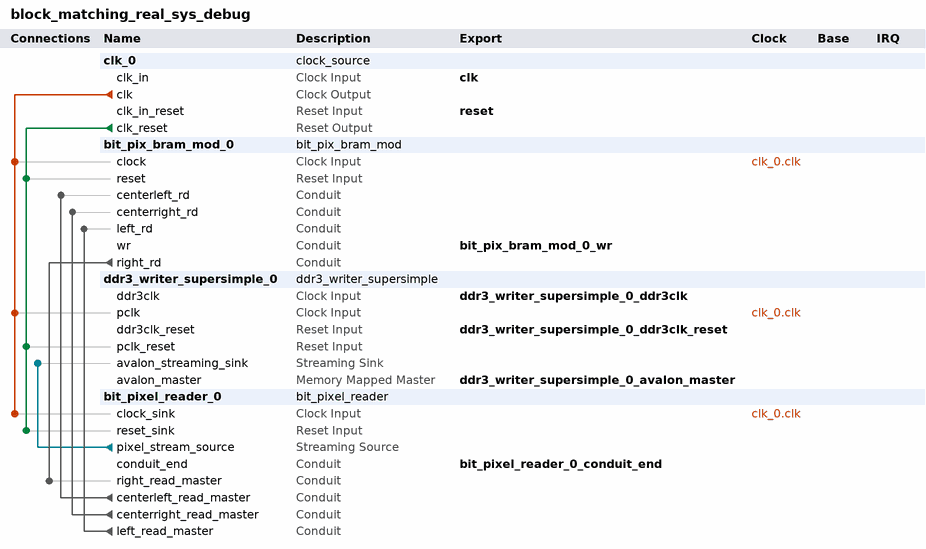
[diagram p0: system contents]
# Platform Designer (Qsys) system block_matching_real_sys_debug, Cyclone V 5CSEBA6U23I7
# Parameters at their usual value, and those the tool derives, are not listed.
package require -exact qsys 18.1
create_system block_matching_real_sys_debug
set_project_property DEVICE_FAMILY {Cyclone V}
set_project_property DEVICE 5CSEBA6U23I7

add_instance clk_0 clock_source 18.1
set_instance_parameter_value clk_0 clockFrequency 50000000

add_instance bit_pix_bram_mod_0 bit_pix_bram_mod 1.0
set_instance_parameter_value bit_pix_bram_mod_0 center_width 304
set_instance_parameter_value bit_pix_bram_mod_0 rd_width 8
set_instance_parameter_value bit_pix_bram_mod_0 third_height 480
set_instance_parameter_value bit_pix_bram_mod_0 third_width 240
set_instance_parameter_value bit_pix_bram_mod_0 wr_width 16

add_instance ddr3_writer_supersimple_0 ddr3_writer_supersimple 1.0
set_instance_parameter_value ddr3_writer_supersimple_0 burst_len 8
set_instance_parameter_value ddr3_writer_supersimple_0 in_width 64
set_instance_parameter_value ddr3_writer_supersimple_0 num_pixels 376320
set_instance_parameter_value ddr3_writer_supersimple_0 start_address 922746880

add_instance bit_pixel_reader_0 bit_pixel_reader 1.0
set_instance_parameter_value bit_pixel_reader_0 center_width 304
set_instance_parameter_value bit_pixel_reader_0 third_height 480
set_instance_parameter_value bit_pixel_reader_0 third_width 240

# connections
add_connection clk_0.clk bit_pix_bram_mod_0.clock clock
add_connection clk_0.clk bit_pixel_reader_0.clock_sink clock
add_connection clk_0.clk ddr3_writer_supersimple_0.pclk clock
add_connection clk_0.clk_reset bit_pix_bram_mod_0.reset reset
add_connection clk_0.clk_reset bit_pixel_reader_0.reset_sink reset
add_connection clk_0.clk_reset ddr3_writer_supersimple_0.pclk_reset reset
add_connection bit_pixel_reader_0.pixel_stream_source ddr3_writer_supersimple_0.avalon_streaming_sink avalon_streaming
add_connection bit_pix_bram_mod_0.right_rd bit_pixel_reader_0.right_read_master conduit
add_connection bit_pixel_reader_0.centerleft_read_master bit_pix_bram_mod_0.centerleft_rd conduit
add_connection bit_pixel_reader_0.centerright_read_master bit_pix_bram_mod_0.centerright_rd conduit
add_connection bit_pixel_reader_0.left_read_master bit_pix_bram_mod_0.left_rd conduit

# exported interfaces
add_interface bit_pix_bram_mod_0_wr conduit end
set_interface_property bit_pix_bram_mod_0_wr EXPORT_OF bit_pix_bram_mod_0.wr
add_interface bit_pixel_reader_0_conduit_end conduit end
set_interface_property bit_pixel_reader_0_conduit_end EXPORT_OF bit_pixel_reader_0.conduit_end
add_interface clk clock sink
set_interface_property clk EXPORT_OF clk_0.clk_in
add_interface ddr3_writer_supersimple_0_avalon_master avalon master
set_interface_property ddr3_writer_supersimple_0_avalon_master EXPORT_OF ddr3_writer_supersimple_0.avalon_master
add_interface ddr3_writer_supersimple_0_ddr3clk clock sink
set_interface_property ddr3_writer_supersimple_0_ddr3clk EXPORT_OF ddr3_writer_supersimple_0.ddr3clk
add_interface ddr3_writer_supersimple_0_ddr3clk_reset reset sink
set_interface_property ddr3_writer_supersimple_0_ddr3clk_reset EXPORT_OF ddr3_writer_supersimple_0.ddr3clk_reset
add_interface reset reset sink
set_interface_property reset EXPORT_OF clk_0.clk_in_reset

set_interconnect_requirement {$system} qsys_mm.clockCrossingAdapter HANDSHAKE
set_interconnect_requirement {$system} qsys_mm.enableEccProtection FALSE
set_interconnect_requirement {$system} qsys_mm.insertDefaultSlave FALSE
set_interconnect_requirement {$system} qsys_mm.maxAdditionalLatency 1

save_system block_matching_real_sys_debug.qsys
